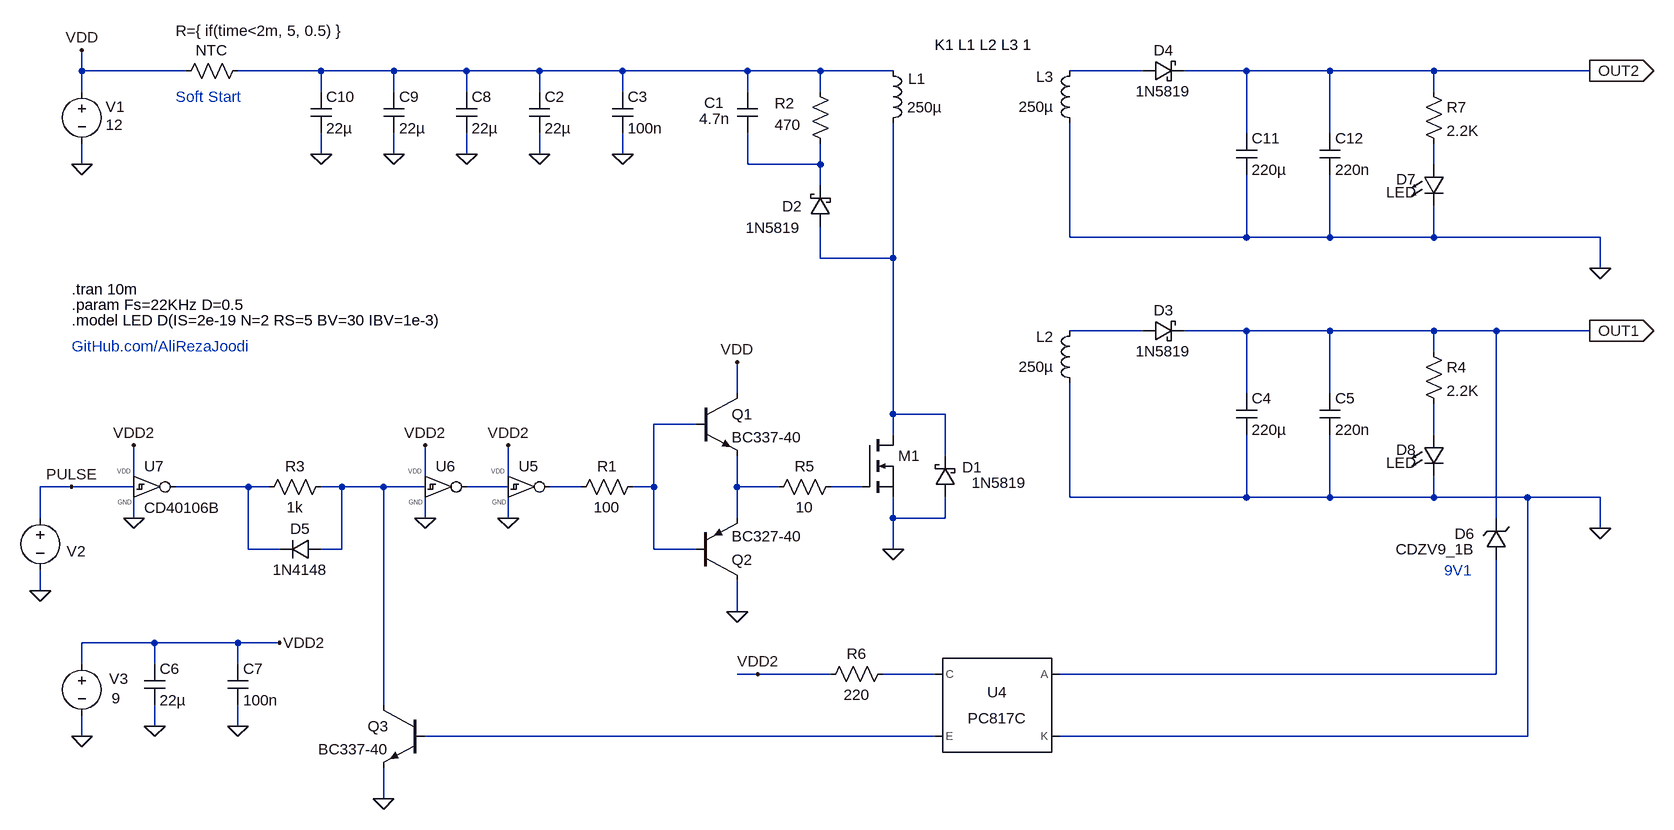
[diagram p0: schematic v1.0.asc]
v1.0.asc, the LTspice schematic file:
Version 4.1
SHEET 1 2444 1460
WIRE -32 192 -32 160
WIRE 128 192 -32 192
WIRE 336 192 208 192
WIRE 448 192 336 192
WIRE 560 192 448 192
WIRE 672 192 560 192
WIRE 800 192 672 192
WIRE 992 192 800 192
WIRE 1104 192 992 192
WIRE 1216 192 1104 192
WIRE 1600 192 1488 192
WIRE 1760 192 1664 192
WIRE 1888 192 1760 192
WIRE 2048 192 1888 192
WIRE 2288 192 2048 192
WIRE -32 224 -32 192
WIRE 336 224 336 192
WIRE 448 224 448 192
WIRE 560 224 560 192
WIRE 672 224 672 192
WIRE 800 224 800 192
WIRE 992 224 992 192
WIRE 1104 224 1104 192
WIRE 2048 224 2048 192
WIRE 1760 288 1760 192
WIRE 1888 288 1888 192
WIRE 336 320 336 288
WIRE 448 320 448 288
WIRE 560 320 560 288
WIRE 672 320 672 288
WIRE 800 320 800 288
WIRE -32 336 -32 304
WIRE 992 336 992 288
WIRE 1104 336 1104 304
WIRE 1104 336 992 336
WIRE 2048 336 2048 304
WIRE 1104 368 1104 336
WIRE 1488 448 1488 272
WIRE 1760 448 1760 352
WIRE 1760 448 1488 448
WIRE 1888 448 1888 352
WIRE 1888 448 1760 448
WIRE 2048 448 2048 400
WIRE 2048 448 1888 448
WIRE 2304 448 2048 448
WIRE 1104 480 1104 432
WIRE 1216 480 1216 272
WIRE 1216 480 1104 480
WIRE 2304 496 2304 448
WIRE 1600 592 1488 592
WIRE 1760 592 1664 592
WIRE 1888 592 1760 592
WIRE 2048 592 1888 592
WIRE 2144 592 2048 592
WIRE 2288 592 2144 592
WIRE 2048 624 2048 592
WIRE 976 688 976 640
WIRE 1760 688 1760 592
WIRE 1888 688 1888 592
WIRE 1216 720 1216 480
WIRE 1296 720 1216 720
WIRE 912 736 848 736
WIRE 1216 752 1216 720
WIRE 2048 752 2048 704
WIRE 1296 784 1296 720
WIRE 48 816 48 768
WIRE 496 816 496 768
WIRE 624 816 624 768
WIRE -48 832 -96 832
WIRE 48 832 -48 832
WIRE 224 832 112 832
WIRE 256 832 224 832
WIRE 368 832 336 832
WIRE 432 832 368 832
WIRE 496 832 432 832
WIRE 624 832 560 832
WIRE 736 832 688 832
WIRE 848 832 848 736
WIRE 848 832 816 832
WIRE 976 832 976 784
WIRE 1040 832 976 832
WIRE 1168 832 1120 832
WIRE 1488 848 1488 672
WIRE 1760 848 1760 752
WIRE 1760 848 1488 848
WIRE 1888 848 1888 752
WIRE 1888 848 1760 848
WIRE 2048 848 2048 816
WIRE 2048 848 1888 848
WIRE 2192 848 2048 848
WIRE 2304 848 2192 848
WIRE -96 880 -96 832
WIRE 48 880 48 848
WIRE 496 880 496 848
WIRE 624 880 624 848
WIRE 976 880 976 832
WIRE 1216 880 1216 848
WIRE 1296 880 1296 848
WIRE 1296 880 1216 880
WIRE 2144 880 2144 592
WIRE 2304 896 2304 848
WIRE 224 928 224 832
WIRE 272 928 224 928
WIRE 368 928 368 832
WIRE 368 928 336 928
WIRE 848 928 848 832
WIRE 912 928 848 928
WIRE 1216 928 1216 880
WIRE -96 992 -96 960
WIRE 976 1024 976 976
WIRE 80 1072 -32 1072
WIRE 208 1072 80 1072
WIRE 272 1072 208 1072
WIRE -32 1104 -32 1072
WIRE 80 1104 80 1072
WIRE 208 1104 208 1072
WIRE 1008 1120 976 1120
WIRE 1120 1120 1008 1120
WIRE 1280 1120 1200 1120
WIRE 2144 1120 2144 944
WIRE 2144 1120 1472 1120
WIRE 432 1168 432 832
WIRE 80 1200 80 1168
WIRE 208 1200 208 1168
WIRE -32 1216 -32 1184
WIRE 1280 1216 496 1216
WIRE 2192 1216 2192 848
WIRE 2192 1216 1472 1216
WIRE 432 1312 432 1264
FLAG -32 336 0
FLAG -96 992 0
FLAG -48 832 PULSE
FLAG 1216 928 0
FLAG 672 320 0
FLAG 800 320 0
FLAG 2304 896 0
FLAG 2288 592 OUT1
IOPIN 2288 592 Out
FLAG -32 160 VDD
FLAG 976 640 VDD
FLAG 976 1024 0
FLAG 48 880 0
FLAG 48 768 VDD2
FLAG 496 880 0
FLAG 496 768 VDD2
FLAG 624 880 0
FLAG 624 768 VDD2
FLAG 432 1312 0
FLAG 1008 1120 VDD2
FLAG -32 1216 0
FLAG 272 1072 VDD2
FLAG 80 1200 0
FLAG 208 1200 0
FLAG 560 320 0
FLAG 448 320 0
FLAG 336 320 0
FLAG 2304 496 0
FLAG 2288 192 OUT2
IOPIN 2288 192 Out
SYMBOL voltage -32 208 R0
WINDOW 123 0 0 Left 0
WINDOW 39 24 105 Left 2
WINDOW 0 37 39 Left 2
WINDOW 3 37 67 Left 2
SYMATTR InstName V1
SYMATTR Value 12
SYMBOL voltage -96 864 R0
WINDOW 123 0 0 Left 0
WINDOW 39 0 0 Left 0
WINDOW 0 41 67 Left 2
WINDOW 3 -361 80 Invisible 2
SYMATTR InstName V2
SYMATTR Value PULSE(0 12 0 {0.01/Fs} {0.01/Fs} {D/Fs} {1/Fs})
SYMBOL ind 1200 288 M180
WINDOW 0 39 84 Left 2
WINDOW 3 38 40 Left 2
SYMATTR InstName L1
SYMATTR Value 250µ
SYMATTR SpiceLine Rser=0.07
SYMATTR Type ind
SYMBOL cap 1008 288 R180
WINDOW 0 52 47 Left 2
WINDOW 3 43 22 Left 2
SYMATTR InstName C1
SYMATTR Value 4.7n
SYMBOL res 1088 208 R0
WINDOW 0 -54 34 Left 2
WINDOW 3 -54 67 Left 2
SYMATTR InstName R2
SYMATTR Value 470
SYMBOL nmos 1168 752 R0
WINDOW 3 56 72 Invisible 2
SYMATTR Value BSC100N06LS3
SYMATTR InstName M1
SYMBOL cap 656 224 R0
SYMATTR InstName C2
SYMATTR Value 22µ
SYMBOL schottky 1120 432 R180
WINDOW 0 44 32 Left 2
WINDOW 3 131 -1 Right 2
SYMATTR InstName D2
SYMATTR Value 1N5819
SYMBOL cap 784 224 R0
SYMATTR InstName C3
SYMATTR Value 100n
SYMBOL schottky 1312 848 R180
WINDOW 0 -41 46 Left 2
WINDOW 3 -110 22 Left 2
SYMATTR InstName D1
SYMATTR Value 1N5819
SYMBOL ind 1504 576 M0
WINDOW 0 41 25 Left 2
WINDOW 3 41 71 Left 2
SYMATTR InstName L2
SYMATTR Value 250µ
SYMATTR SpiceLine Rser=0.07
SYMATTR Type ind
SYMBOL schottky 1600 608 R270
WINDOW 0 32 32 VTop 2
WINDOW 3 0 32 VBottom 2
SYMATTR InstName D3
SYMATTR Value 1N5819
SYMBOL cap 1744 688 R0
SYMATTR InstName C4
SYMATTR Value 220µ
SYMBOL cap 1872 688 R0
SYMATTR InstName C5
SYMATTR Value 220n
SYMBOL res 2032 608 R0
SYMATTR InstName R4
SYMATTR Value 2.2K
SYMBOL npn 912 688 R0
SYMATTR InstName Q1
SYMATTR Value BC337-40
SYMBOL pnp 912 976 M180
SYMATTR InstName Q2
SYMATTR Value BC327-40
SYMBOL res 1136 816 R90
WINDOW 0 0 56 VBottom 2
WINDOW 3 32 56 VTop 2
SYMATTR InstName R5
SYMATTR Value 10
SYMBOL res 832 816 R90
WINDOW 0 0 56 VBottom 2
WINDOW 3 32 56 VTop 2
SYMATTR InstName R1
SYMATTR Value 100
SYMBOL res 352 816 R90
WINDOW 0 0 56 VBottom 2
WINDOW 3 32 56 VTop 2
SYMATTR InstName R3
SYMATTR Value 1k
SYMBOL diode 336 912 R90
WINDOW 0 0 32 VBottom 2
WINDOW 3 32 32 VTop 2
SYMATTR InstName D5
SYMATTR Value 1N4148
SYMBOL npn 496 1168 M0
SYMATTR InstName Q3
SYMATTR Value BC337-40
SYMBOL res 1216 1104 R90
WINDOW 0 0 56 VBottom 2
WINDOW 3 32 56 VTop 2
SYMATTR InstName R6
SYMATTR Value 220
SYMBOL Optos\\PC817C 1376 1168 M0
SYMATTR InstName U4
SYMBOL zener 2160 944 R180
WINDOW 0 49 40 Left 2
WINDOW 3 49 16 Left 2
SYMATTR InstName D6
SYMATTR Value CDZV9_1B
SYMBOL voltage -32 1088 R0
WINDOW 0 42 39 Left 2
WINDOW 3 46 69 Left 2
WINDOW 123 0 0 Left 0
WINDOW 39 0 0 Left 0
SYMATTR InstName V3
SYMATTR Value 9
SYMBOL cap 64 1104 R0
SYMATTR InstName C6
SYMATTR Value 22µ
SYMBOL cap 192 1104 R0
SYMATTR InstName C7
SYMATTR Value 100n
SYMBOL cap 544 224 R0
SYMATTR InstName C8
SYMATTR Value 22µ
SYMBOL cap 432 224 R0
SYMATTR InstName C9
SYMATTR Value 22µ
SYMBOL cap 320 224 R0
SYMATTR InstName C10
SYMATTR Value 22µ
SYMBOL ind 1504 176 M0
WINDOW 0 41 25 Left 2
WINDOW 3 41 71 Left 2
SYMATTR InstName L3
SYMATTR Value 250µ
SYMATTR SpiceLine Rser=0.07
SYMATTR Type ind
SYMBOL schottky 1600 208 R270
WINDOW 0 32 32 VTop 2
WINDOW 3 0 32 VBottom 2
SYMATTR InstName D4
SYMATTR Value 1N5819
SYMBOL cap 1744 288 R0
SYMATTR InstName C11
SYMATTR Value 220µ
SYMBOL cap 1872 288 R0
SYMATTR InstName C12
SYMATTR Value 220n
SYMBOL res 2032 208 R0
SYMATTR InstName R7
SYMATTR Value 2.2K
SYMBOL res 224 176 R90
WINDOW 0 0 56 VBottom 2
WINDOW 3 -61 -17 VTop 2
SYMATTR InstName NTC
SYMATTR Value R={ if(time<2m, 5, 0.5) }
SYMBOL MyLib\\Digital\\CD40106B 624 800 R0
WINDOW 38 16 64 Invisible 2
SYMATTR InstName U5
SYMBOL MyLib\\Digital\\CD40106B 496 800 R0
WINDOW 38 16 64 Invisible 2
SYMATTR InstName U6
SYMBOL MyLib\\Digital\\CD40106B 48 800 R0
SYMATTR InstName U7
SYMBOL LED 2032 336 R0
WINDOW 0 -42 23 Left 2
WINDOW 3 -57 43 Left 2
SYMATTR InstName D7
SYMATTR Value LED
SYMBOL LED 2032 752 R0
WINDOW 0 -42 23 Left 2
WINDOW 3 -57 43 Left 2
SYMATTR InstName D8
SYMATTR Value LED
TEXT -48 528 Left 2 !.tran 10m
TEXT 1280 152 Left 2 !K1 L1 L2 L3 1
TEXT -48 552 Left 2 !.param Fs=22KHz D=0.5
TEXT 112 232 Left 2 ;Soft Start
TEXT 2064 960 Left 2 ;9V1
TEXT -48 576 Left 2 !.model LED D(IS=2e-19 N=2 RS=5 BV=30 IBV=1e-3)
TEXT -48 616 Left 2 ;GitHub.com/AliRezaJoodi

The netlist it stands for:
* v1.0.asc
V1 VDD 0 12
V2 PULSE 0 PULSE(0 12 0 {0.01/Fs} {0.01/Fs} {D/Fs} {1/Fs})
L1 N005 N001 250µ Rser=0.07
C1 N003 N001 4.7n
R2 N001 N003 470
M1 N005 N014 0 0 BSC100N06LS3
C2 N001 0 22µ
D2 N005 N003 1N5819
C3 N001 0 100n
D1 0 N005 1N5819
L2 N006 0 250µ Rser=0.07
D3 N006 OUT1 1N5819
C4 OUT1 0 220µ
C5 OUT1 0 220n
R4 OUT1 N008 2.2K
Q1 VDD N007 N013 0 BC337-40
Q2 0 N007 N013 0 BC327-40
R5 N014 N013 10
R1 N007 N012 100
R3 N010 N009 1k
D5 N010 N009 1N4148
Q3 N010 N017 0 0 BC337-40
R6 N015 VDD2 220
X§U4 N016 0 N015 N017 PC817 Igain=2.3m  ; PC817C, pins A K C E
D6 N016 OUT1 CDZV9_1B
V3 VDD2 0 9
C6 VDD2 0 22µ
C7 VDD2 0 100n
C8 N001 0 22µ
C9 N001 0 22µ
C10 N001 0 22µ
L3 N002 0 250µ Rser=0.07
D4 N002 OUT2 1N5819
C11 OUT2 0 220µ
C12 OUT2 0 220n
R7 OUT2 N004 2.2K
R§NTC N001 VDD R={ if(time<2m, 5, 0.5) }
X§U5 N011 N012 VDD2 0 CD40106B vdd=5 speed=2 tripdt=100n  ; pins in out VDD GND
X§U6 N010 N011 VDD2 0 CD40106B vdd=5 speed=2 tripdt=100n  ; pins in out VDD GND
X§U7 PULSE N009 VDD2 0 CD40106B vdd=5 speed=2 tripdt=100n  ; pins in out VDD GND
D7 N004 0 LED
D8 N008 0 LED
.model D D
.lib standard.dio
.model NPN NPN
.model PNP PNP
.lib standard.bjt
.model NMOS NMOS
.model PMOS PMOS
.lib standard.mos
.tran 10m
K1 L1 L2 L3 1
.param Fs=22KHz D=0.5
* Soft Start
* 9V1
.model LED D(IS=2e-19 N=2 RS=5 BV=30 IBV=1e-3)
* GitHub.com/AliRezaJoodi
.lib PC817.sub
.lib MyLib/Digital/_CD4xxx.lib
.backanno
.end